# Altium schematic sheet USB2_host_otg.SchDoc
size A3; SheetNumber: 17; SheetTotal: 21
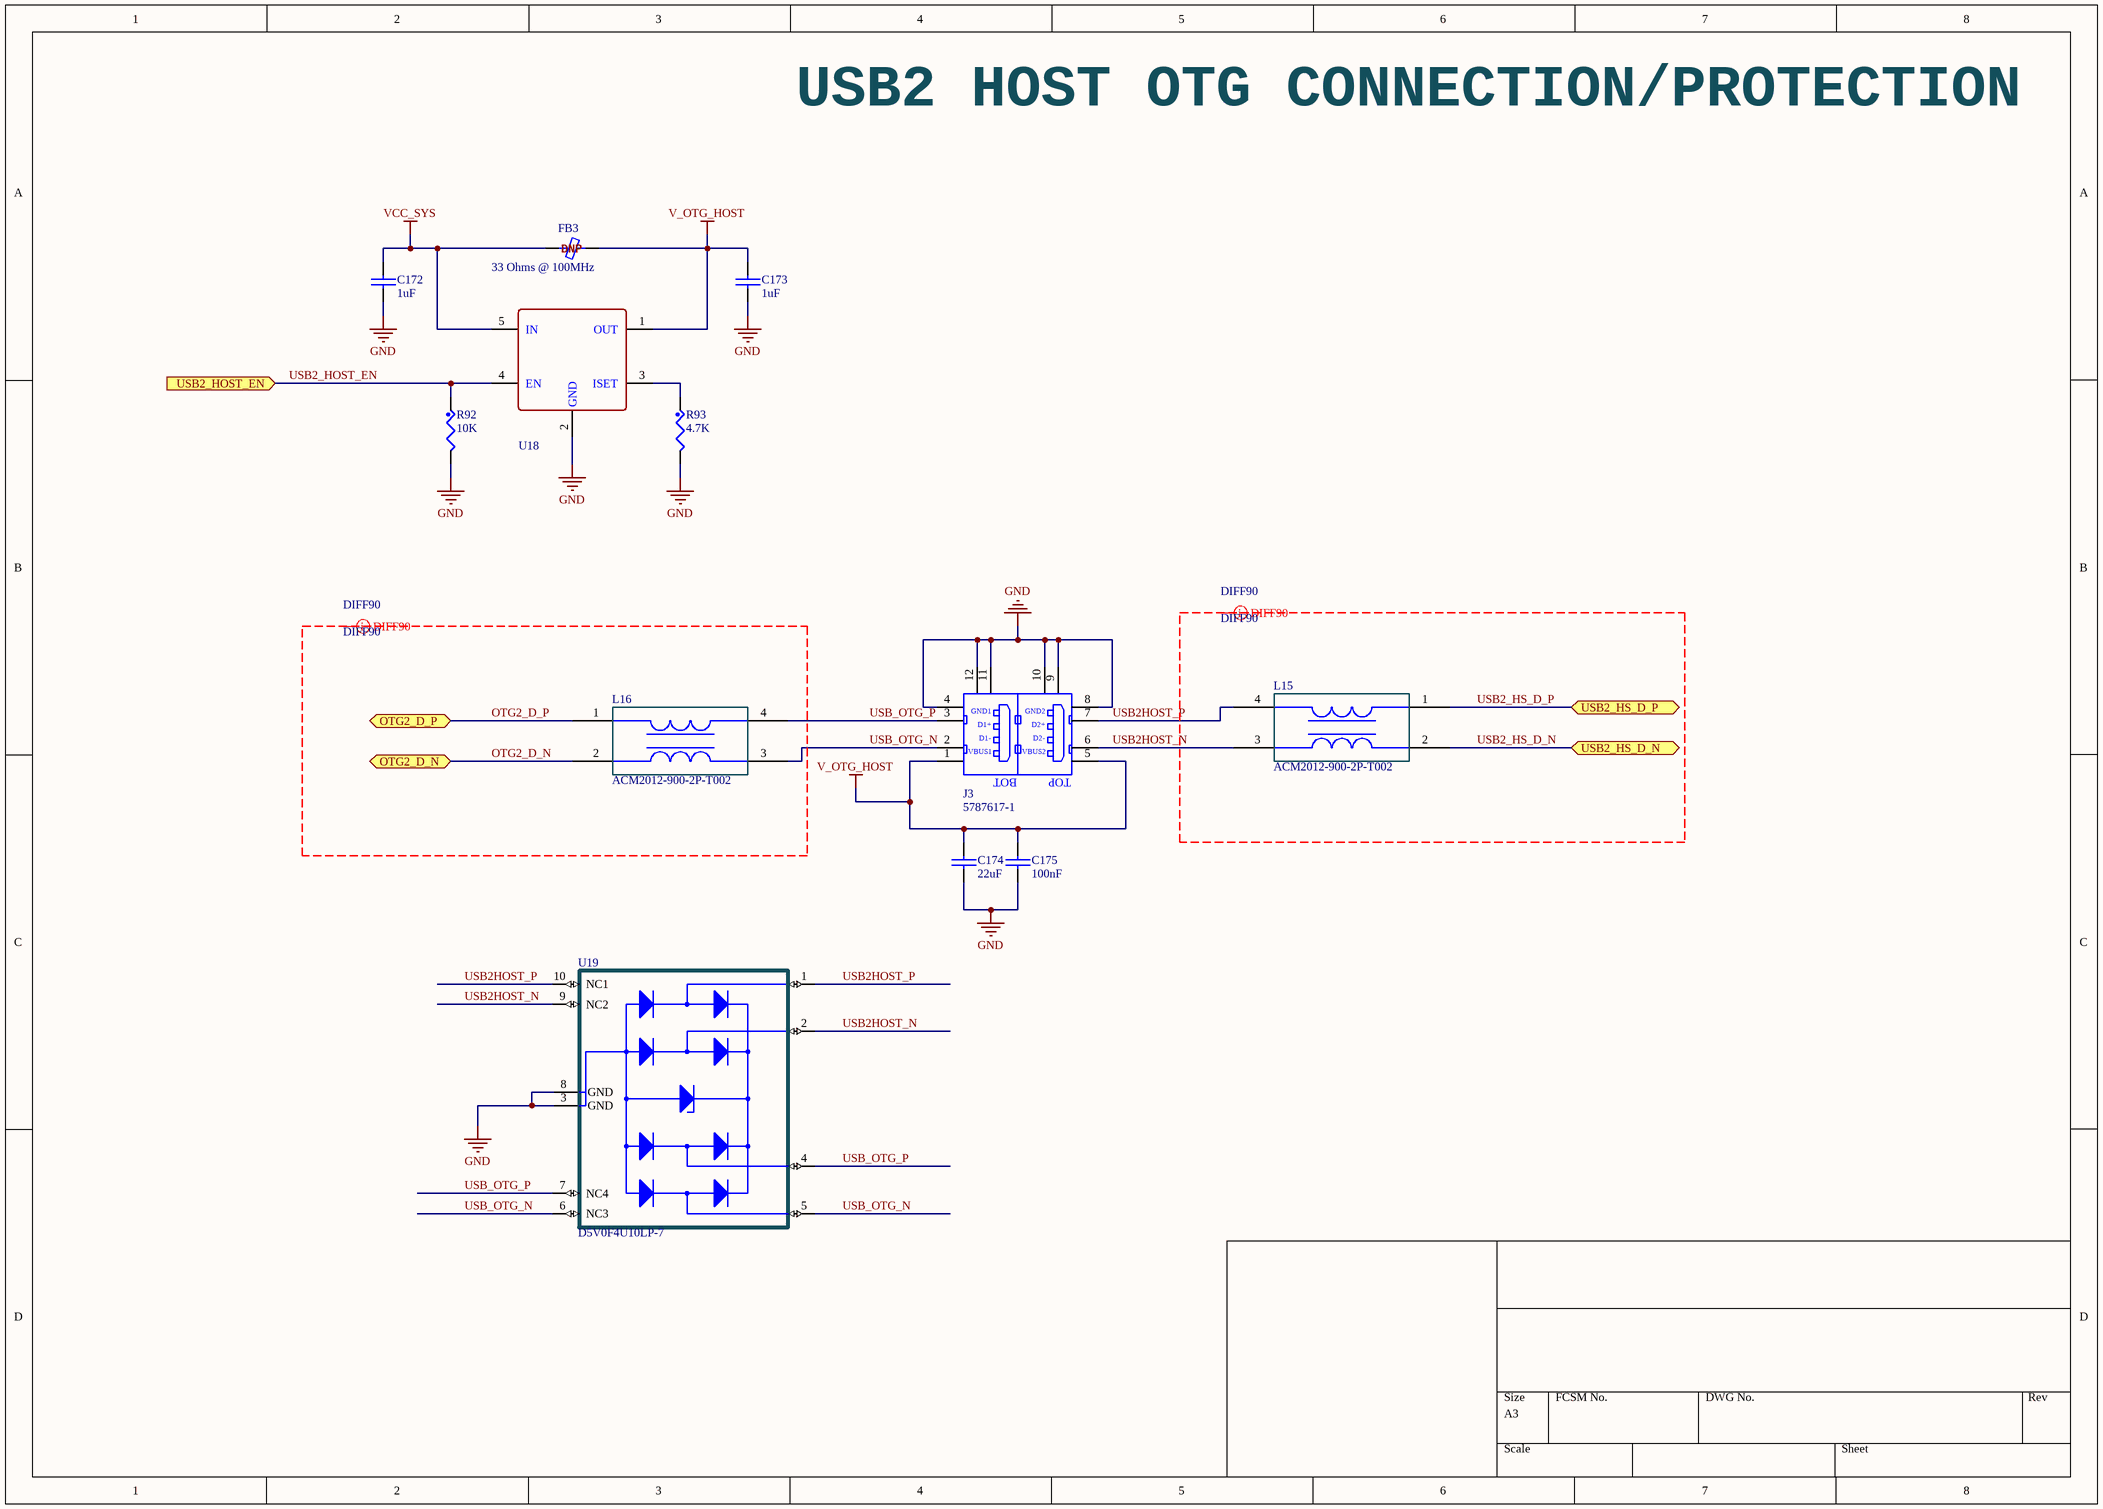
[diagram p0: USB2_host_otg.SchDoc]

## Parts
C172  1uF  [0603_CC]
C173  1uF  [0603_CC]
C174  22uF  [0603_CC]
C175  100nF  [0402_CC - C]
FB3  33 Ohms @ 100MHz  [FER 0805_2012]
J3  5787617-1  [USB-2A]
L15  ACM2012-900-2P-T002  [FP-ACM2012-MFG]
L16  ACM2012-900-2P-T002  [FP-ACM2012-MFG]
R92  10K  [0402_CR]
R93  4.7K  [0402_CR]
U18  Switch  [SOT23_5]  (value not drawn)
U19  D5V0F4U10LP-7  [TI_TPD4E05U06DQAR]

## Ports
OTG2_D_N (bidir), OTG2_D_P (bidir), USB2_HOST_EN (in), USB2_HS_D_N (bidir), USB2_HS_D_P (bidir)

## Nets
GND: C172.2 C173.2 C174.2 C175.2 J3.4(GND) J3.8(GND) J3.9(SHIELD) J3.10(SHIELD) J3.11(SHIELD) J3.12(SHIELD) R92.2 R93.2 U18.2(GND) U19.3(GND) U19.8(GND)
V_OTG_HOST: C173.1 C174.1 C175.1 FB3.2 J3.1(VBUS) J3.5(VBUS2) U18.1(OUT)
VCC_SYS: C172.1 FB3.1 U18.5(IN)
OTG2_D_N: L16.2 ; port OTG2_D_N
OTG2_D_P: L16.1 ; port OTG2_D_P
USB2_HOST_EN: R92.1 U18.4(EN) ; port USB2_HOST_EN
USB2_HS_D_N: L15.2 ; port USB2_HS_D_N
USB2_HS_D_P: L15.1 ; port USB2_HS_D_P
USB2HOST_N: J3.6(D2-) L15.3 U19.2(D1-) U19.9(NC2)
USB2HOST_P: J3.7(D2+) L15.4 U19.1(D1+) U19.10(NC1)
USB_OTG_N: J3.2(D-) L16.3 U19.5(D2-) U19.6(NC3)
USB_OTG_P: J3.3(D+) L16.4 U19.4(D2+) U19.7(NC4)
NetR93_1: R93.1 U18.3(ISET)

## Layout directives
differential pair; differential pair class DIFF90; net class DIFF90: OTG2_D_N, OTG2_D_P, USB2_HS_D_N, USB2_HS_D_P

## Notes on the sheet
- USB2 HOST OTG CONNECTION/PROTECTION
- (near FB3) DNP
- (in symbol 5787617-1_v1.1) GND1; GND2; D1+; D1-; VBUS1; BOT; TOP

## Library data of the parts
C172-C175 = CAP_NP: CLASS: DISCRETE
FB3 = Z0805C330ASMST: FERRITE BEAD 33 OHM 0805 1LN; Manufacturer: KEMET; Current Rating (Max): 1.2A; DC Resistance (DCR) (Max): 50mOhm; Filter Type: Signal Line; Number of Lines: 1; Part Number: Z0805C330ASMST; ComponentLink1Description: Datasheet; ComponentLink1URL: https://content.kemet.com/datasheets/F3115.pdf; ComponentLink2Description: DigiKey Link; ComponentLink2URL: http://digikey.com/product-detail/en/kemet/Z0805C330ASMST/399-9619-1-ND/3674058; Device Package: 0805 (2012 Metric); Height (Max): 0.041" (1.05mm); Impedance @ Frequency: 33 Ohms @ 100MHz; LastUpdated: 3/24/2022 2:23:39 PM; Lifecycle Status: Active; Minimum Order: 1; Mounting Type: Surface Mount; Operating Temperature: -55°C ~ 125°C; Package / Case: 0805 (2012 Metric); Packaging: TapeAndReel; PartId: 1206; Part Status: Active; Price: 0.04; Series: Z-SMS; Size / Dimension: 0.079" L x 0.049" W (2.00mm x 1.25mm); Supplier 1: DigiKey; Supplier Part Number 1: 399-9619-1-ND; Value: 33 Ohms @ 100MHz
J3 = 5787617-1_v1.1: CONN RCPT R/A 4OVER4POS GOLD PCB; Manufacturer: TE Connectivity; Connector Type: USB - A, Stacked; Number of Contacts: 8; Gender: Receptacle; Specifications: USB 2.0; Category: Connectors, Interconnects; Family: USB, IEEE-1394 (Firewire), DVI, HDMI; Manufacturer Part Number: 5787617-1; Price 1k [$]: 1.68753; Supplier: Digikey; Supplier Part Number: A31728-ND; Value: 5787617-1; Supplier 1: Digi-Key; Supplier Part Number 1: A31728-ND; RoHS: RoHS Compliant; Stock 1: 5401; Pricing 1: 1=3.33, 10=3.197, 25=2.9308, 50=2.7978, 100=2.6645, 250=2.33144, 500=2.26484, 1000=1.93178, 2500=1.79855 (USD); Mounting Type: Through Hole, Right Angle, Horizontal; Features: Board Lock; Packaging: Tray; ComponentLink1URL: http://documents.tycoelectronics.com/commerce/DocumentDelivery/DDEController?Action=srchrtrv&DocNm=5787617&DocType=CD&DocLang=EN; ComponentLink1Description: http://documents.tycoelectronics.com/commerce/DocumentDelivery/DDEController?Action=srchrtrv&DocNm=5787617&DocType=CD&DocLang=EN
L15 L16 = ACM2012-900-2P-T002: CMC 400MA 2LN 90 OHM SMD; Mfr_Name: TDK; Type: DEV; Copyright: Copyright (C) 2022 Ultra Librarian. All rights reserved.; Manufacturer_Part_Number: ACM2012-900-2P-T002; Digi-Key_Part_Number_1: 445-2207-2-ND; Digi-Key_Part_Number_2: 445-2207-1-ND; Digi-Key_Part_Number_3: 445-2207-6-ND; Digi-Key_Part_Number_4: 445-2207-2-NDL; RefDes: RefDes
R92 R93 = RES: CLASS: DISCRETE
U18 = SY6280A: SY6280/  SY6280A  is  ultra-low  RDS(ON)  switch  with programmable current limit to protect the power source from  over  current  and  short  circuit  conditions, LIBs By AAR; Mfr_Part_No: SY6280AAC; Manufacturer: Silergy; Foot_Print: SOT-23; Supplier 1: Avnet; Supplier Part Number 1: SY6280AAAC; Package: SOT-23
U19 = D5V0F4U10LP-7: TVS DIODE 5.5VWM 12VC U-DFN2510; Mfr: Diodes Incorporated; Price: None; Availability: Available; Value: *; Package: UFDFN-10 Texas Instruments; Mfr_Part_No: D5V0F4U10LP-7; Creator: AAR